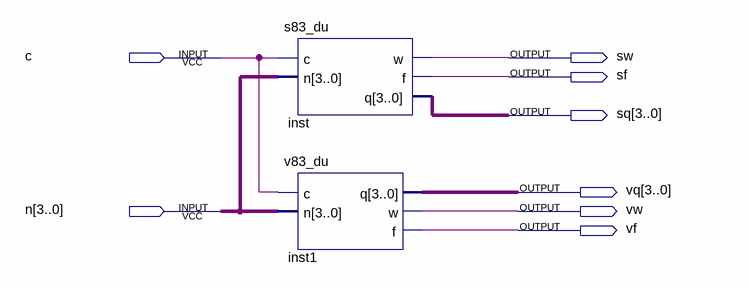
[diagram p0: schematic sheet]
// Quartus schematic sv83_du.bdf as structural Verilog: 2 symbols, 8 pins
module sv83_du (
  input  c,
  input  [3:0] n,
  output sw,
  output sf,
  output [3:0] sq,
  output [3:0] vq,
  output vw,
  output vf
);

  s83_du inst (.c(c), .n(n), .w(sw), .f(sf), .q(sq));
  v83_du inst1 (.c(c), .n(n), .q(vq), .w(vw), .f(vf));
endmodule
